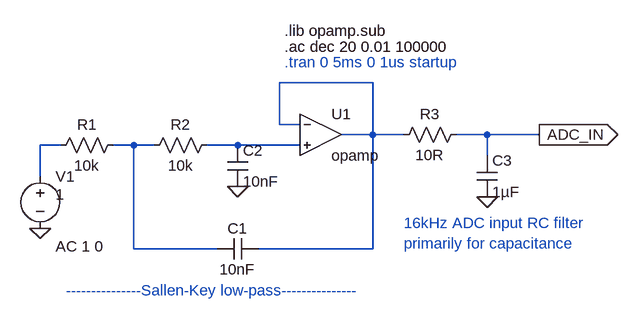
[diagram p0: schematic sk2_filter_1kHz.asc]
sk2_filter_1kHz.asc, the LTspice schematic file:
Version 4.1
SHEET 1 900 680
WIRE 400 80 256 80
WIRE 256 144 256 80
WIRE 288 144 256 144
WIRE 400 160 400 80
WIRE 400 160 352 160
WIRE 448 160 400 160
WIRE 576 160 528 160
WIRE 656 160 576 160
WIRE -80 176 -112 176
WIRE 32 176 0 176
WIRE 64 176 32 176
WIRE 192 176 144 176
WIRE 288 176 192 176
WIRE 576 192 576 160
WIRE -112 224 -112 176
WIRE 32 336 32 176
WIRE 160 336 32 336
WIRE 400 336 400 160
WIRE 400 336 224 336
FLAG -112 304 0
FLAG 192 240 0
FLAG 576 256 0
FLAG 656 160 ADC_IN
IOPIN 656 160 Out
SYMBOL OpAmps\\opamp 320 96 R0
SYMATTR InstName U1
SYMBOL cap 224 320 R90
WINDOW 0 0 32 VBottom 2
WINDOW 3 32 32 VTop 2
SYMATTR InstName C1
SYMATTR Value 10nF
SYMBOL cap 176 176 R0
SYMATTR InstName C2
SYMATTR Value 10nF
SYMBOL res 16 160 R90
WINDOW 0 0 56 VBottom 2
WINDOW 3 32 56 VTop 2
SYMATTR InstName R1
SYMATTR Value 10k
SYMBOL res 160 160 R90
WINDOW 0 0 56 VBottom 2
WINDOW 3 32 56 VTop 2
SYMATTR InstName R2
SYMATTR Value 10k
SYMBOL voltage -112 208 R0
WINDOW 123 24 124 Left 2
WINDOW 39 0 0 Left 0
WINDOW 3 24 44 Left 2
SYMATTR Value2 AC 1 0
SYMATTR InstName V1
SYMATTR Value 1
SYMBOL res 544 144 R90
WINDOW 0 0 56 VBottom 2
WINDOW 3 32 56 VTop 2
SYMATTR InstName R3
SYMATTR Value 10R
SYMBOL cap 560 192 R0
SYMATTR InstName C3
SYMATTR Value 1µF
TEXT 264 24 Left 2 !.ac dec 20 0.01 100000
TEXT 264 0 Left 2 !.lib opamp.sub
TEXT 448 296 Left 2 ;16kHz ADC input RC filter\nprimarily for capacitance
TEXT -72 400 Left 2 ;---------------Sallen-Key low-pass---------------
TEXT 264 48 Left 2 ;.tran 0 5ms 0 1us startup

The netlist it stands for:
* sk2_filter_1kHz.asc
X§U1 N001 N004 N001 opamp Aol=100K GBW=10Meg  ; pins invin noninvin out
C1 N001 N003 10nF
C2 N004 0 10nF
R1 N003 N002 10k
R2 N004 N003 10k
V1 N002 0 1 AC 1 0
R3 ADC_IN N001 10R
C3 ADC_IN 0 1µF
.ac dec 20 0.01 100000
.lib opamp.sub
* 16kHz ADC input RC filter
* primarily for capacitance
* ---------------Sallen-Key low-pass---------------
* .tran 0 5ms 0 1us startup
.backanno
.end